# Altium schematic sheet interface.SchDoc: Interface
size OrCAD B; CheckedBy: liuchao; DrawnBy: liuchao; DocumentNumber: APEX-USB7; Revision: 3.0.0; SheetNumber: 7; SheetTotal: 9
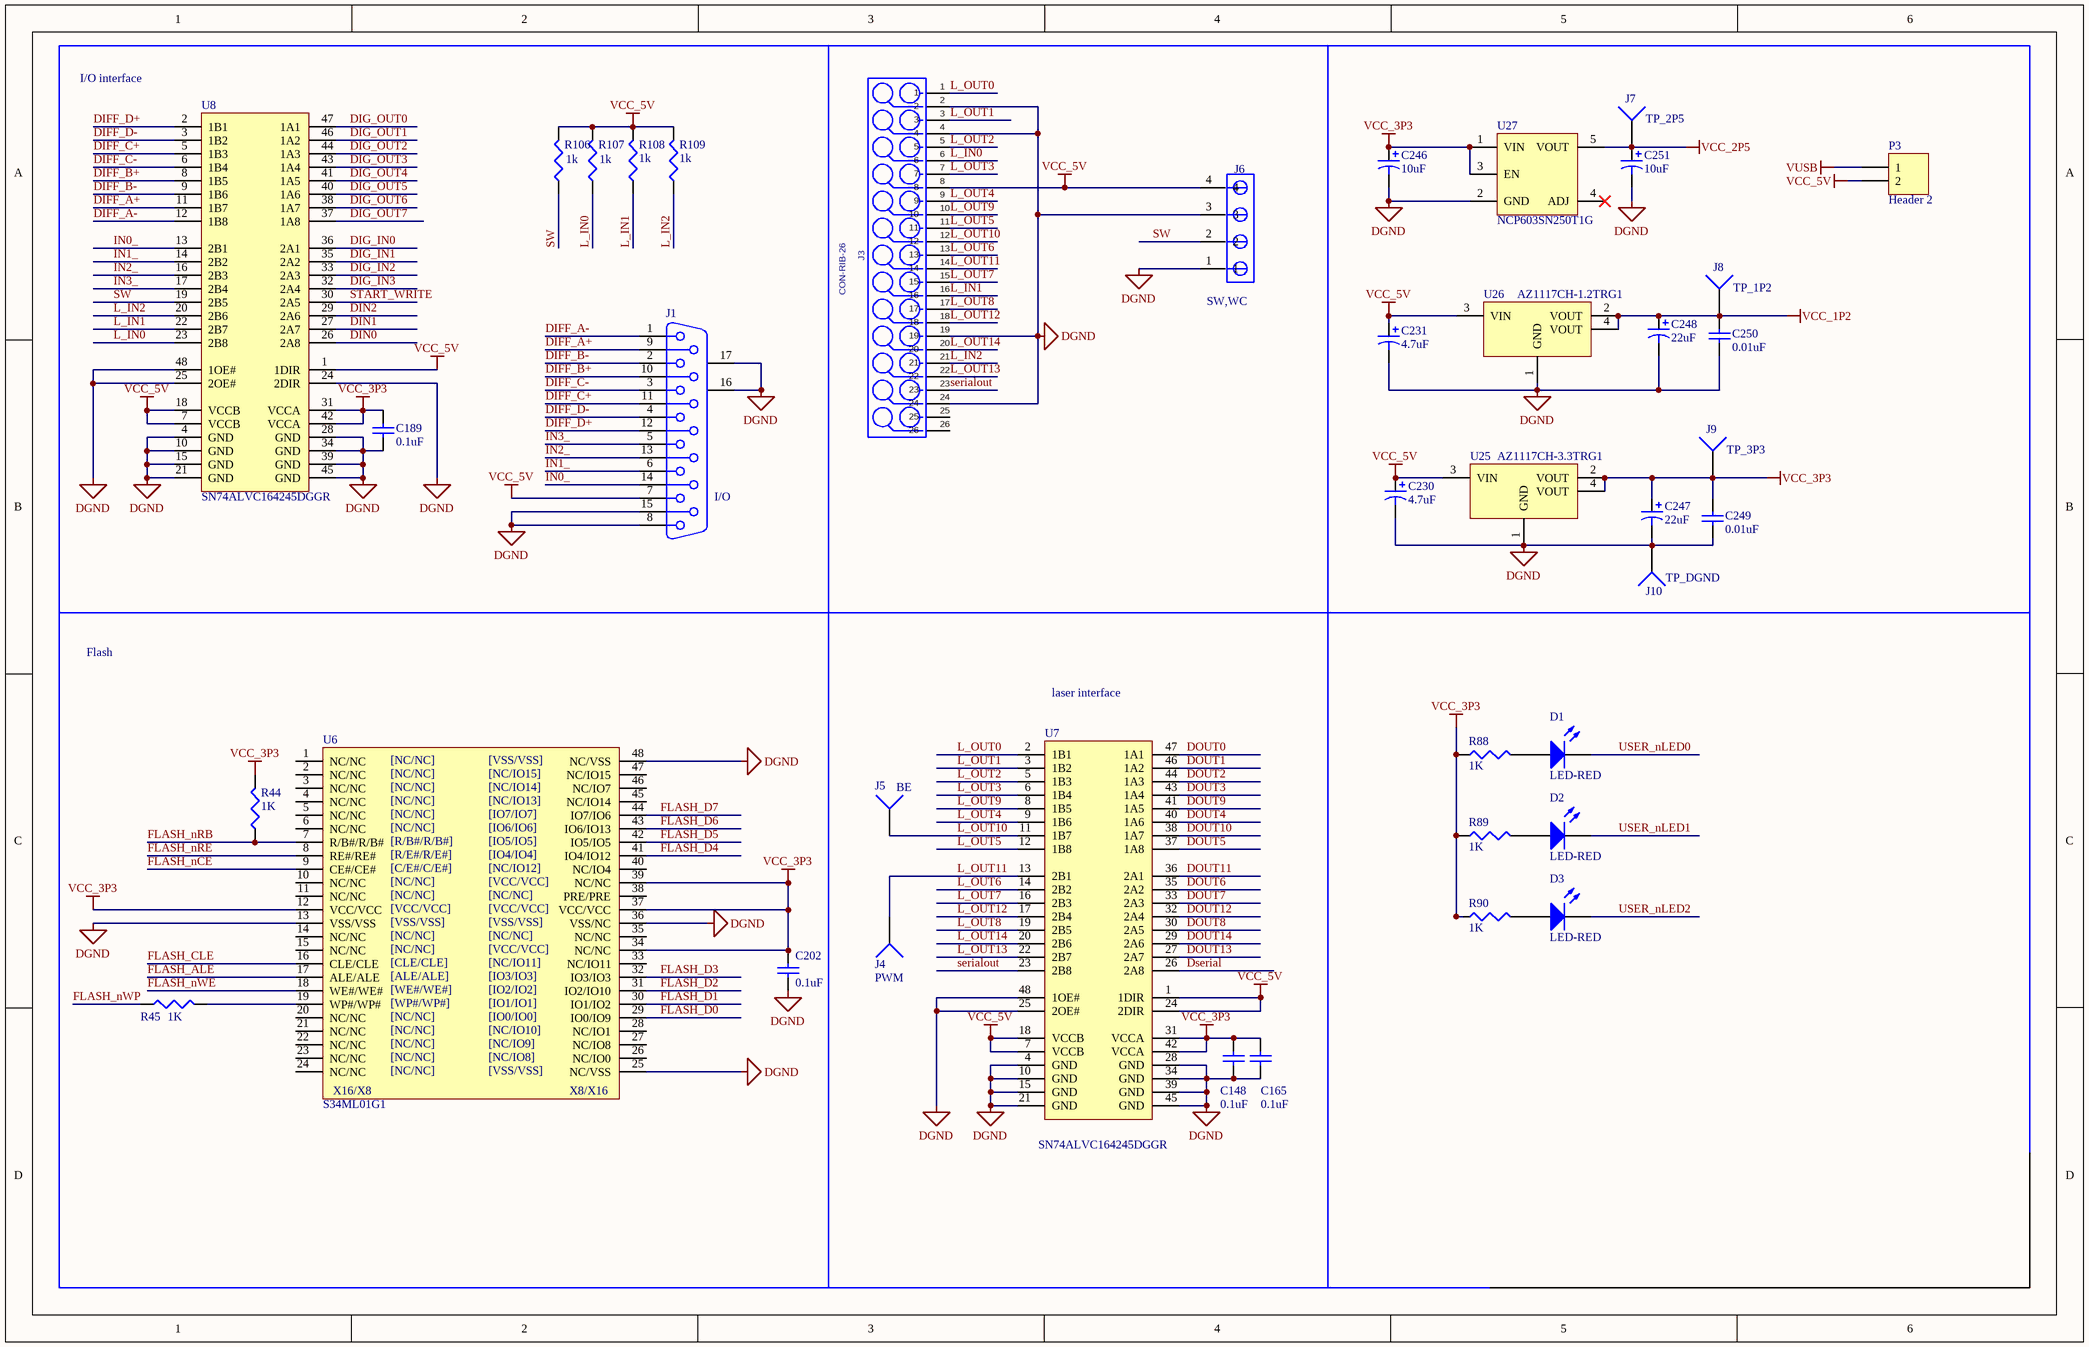
[diagram p0: interface.SchDoc]

## Parts
C148  value 0.1uF  [C_0402]  (hidden comment: Capacitor)
C165  value 0.1uF  [C_0402]  (hidden comment: Capacitor)
C189  value 0.1uF  [C_0402]  (hidden comment: Capacitor)
C202  value 0.1uF  [C_0402]  (hidden comment: Capacitor)
C230  value 4.7uF  [CAP_B]  (hidden comment: Polarized Capacitor)
C231  value 4.7uF  [CAP_B]  (hidden comment: Polarized Capacitor)
C246  value 10uF  [CAP_B]  (hidden comment: Polarized Capacitor)
C247  value 22uF  [CAP_B]  (hidden comment: Polarized Capacitor)
C248  value 22uF  [CAP_B]  (hidden comment: Polarized Capacitor)
C249  value 0.01uF  [C_0402]  (hidden comment: Capacitor)
C250  value 0.01uF  [C_0402]  (hidden comment: Capacitor)
C251  value 10uF  [CAP_B]  (hidden comment: Polarized Capacitor)
D1  LED-RED  [3.2X1.6X1.1]
D2  LED-RED  [3.2X1.6X1.1]
D3  LED-RED  [3.2X1.6X1.1]
J1  I/O  [DB15]
J3  CON-RIB-26  [H26-2P54-DIP]
J4  PWM  [1PAD]
J5  BE  [1PAD]
J6  value SW,WC  [2510-4P]  (hidden comment: SIP-4P-100)
J7  TP_2P5  [1PAD]
J8  TP_1P2  [1PAD]
J9  TP_3P3  [1PAD]
J10  TP_DGND  [1PAD]
P3  Header 2  [HDR1X2]
R44  value 1K  [J1-0603]  (hidden comment: Resistor)
R45  value 1K  [J1-0603]  (hidden comment: Resistor)
R88  value 1K  [J1-0603]  (hidden comment: Resistor)
R89  value 1K  [J1-0603]  (hidden comment: Resistor)
R90  value 1K  [J1-0603]  (hidden comment: Resistor)
R106  value 1k  [J1-0603]  (hidden comment: Resistor)
R107  value 1k  [J1-0603]  (hidden comment: Resistor)
R108  value 1k  [J1-0603]  (hidden comment: Resistor)
R109  value 1k  [J1-0603]  (hidden comment: Resistor)
U6  S34ML01G1  [TSOP48]
U7  SN74ALVC164245DGGR  [TSSOP48_N]
U8  SN74ALVC164245DGGR  [TSSOP48_N]
U25  AZ1117CH-3.3TRG1  [SOT223_N]
U26  AZ1117CH-1.2TRG1  [SOT223_N]
U27  NCP603SN250T1G  [TSOP_5]

## Nets
DGND: C148.2 C165.1 C189.1 C202.1 C230.2 C231.2 C246.2 C247.2 C248.2 C249.2 C250.2 C251.2 J1.8 J1.15 J1.16(MH1) J1.17(MH2) J3.2 J3.4 J3.19 J3.24 J6.1 J6.3 J10.1 U6.13(VSS/VSS) U6.25(NC/VSS) U6.36(VSS/NC) U6.48(NC/VSS) U7.4(GND) U7.10(GND) U7.15(GND) U7.21(GND) U7.25(2OE#) U7.28(GND) U7.34(GND) U7.39(GND) U7.45(GND) U7.48(1OE#) U8.4(GND) U8.10(GND) U8.15(GND) U8.21(GND) U8.24(2DIR) U8.25(2OE#) U8.28(GND) U8.34(GND) U8.39(GND) U8.45(GND) U8.48(1OE#) U25.1(GND) U26.1(GND) U27.2(GND)
VCC_1P2: C248.1 C250.1 J8.1 U26.2(VOUT) U26.4(VOUT)
VCC_2P5: C251.1 J7.1 U27.5(VOUT)
VCC_3P3: C148.1 C165.2 C189.2 C202.2 C246.1 C247.1 C249.1 J9.1 R44.2 R88.1 R89.1 R90.1 U6.12(VCC/VCC) U6.34(NC/NC) U6.37(VCC/VCC) U6.39(NC/NC) U7.31(VCCA) U7.42(VCCA) U8.31(VCCA) U8.42(VCCA) U25.2(VOUT) U25.4(VOUT) U27.1(VIN) U27.3(EN)
VCC_5V: C230.1 C231.1 J1.7 J3.8 J6.4 P3.2 R106.2 R107.2 R108.2 R109.2 U7.1(1DIR) U7.7(VCCB) U7.18(VCCB) U7.24(2DIR) U8.1(1DIR) U8.7(VCCB) U8.18(VCCB) U25.3(VIN) U26.3(VIN)
VUSB: P3.1
DIFF_A+: J1.9 U8.11(1B7)
DIFF_A-: J1.1 U8.12(1B8)
DIFF_B+: J1.10 U8.8(1B5)
DIFF_B-: J1.2 U8.9(1B6)
DIFF_C+: J1.11 U8.5(1B3)
DIFF_C-: J1.3 U8.6(1B4)
DIFF_D+: J1.12 U8.2(1B1)
DIFF_D-: J1.4 U8.3(1B2)
DIG_IN0: U8.36(2A1)
DIG_IN1: U8.35(2A2)
DIG_IN2: U8.33(2A3)
DIG_IN3: U8.32(2A4)
DIG_OUT0: U8.47(1A1)
DIG_OUT1: U8.46(1A2)
DIG_OUT2: U8.44(1A3)
DIG_OUT3: U8.43(1A4)
DIG_OUT4: U8.41(1A5)
DIG_OUT5: U8.40(1A6)
DIG_OUT6: U8.38(1A7)
DIG_OUT7: U8.37(1A8)
DIN0: U8.26(2A8)
DIN1: U8.27(2A7)
DIN2: U8.29(2A6)
DOUT0: U7.47(1A1)
DOUT1: U7.46(1A2)
DOUT2: U7.44(1A3)
DOUT3: U7.43(1A4)
DOUT4: U7.40(1A6)
DOUT5: U7.37(1A8)
DOUT6: U7.35(2A2)
DOUT7: U7.33(2A3)
DOUT8: U7.30(2A5)
DOUT9: U7.41(1A5)
DOUT10: U7.38(1A7)
DOUT11: U7.36(2A1)
DOUT12: U7.32(2A4)
DOUT13: U7.27(2A7)
DOUT14: U7.29(2A6)
Dserial: U7.26(2A8)
FLASH_ALE: U6.17(ALE/ALE)
FLASH_CLE: U6.16(CLE/CLE)
FLASH_D0: U6.29(IO0/IO9)
FLASH_D1: U6.30(IO1/IO2)
FLASH_D2: U6.31(IO2/IO10)
FLASH_D3: U6.32(IO3/IO3)
FLASH_D4: U6.41(IO4/IO12)
FLASH_D5: U6.42(IO5/IO5)
FLASH_D6: U6.43(IO6/IO13)
FLASH_D7: U6.44(IO7/IO6)
FLASH_nCE: U6.9(CE#/CE#)
FLASH_nRB: R44.1 U6.7(R/B#/R/B#)
FLASH_nRE: U6.8(RE#/RE#)
FLASH_nWE: U6.18(WE#/WE#)
FLASH_nWP: R45.1
IN0_: J1.14 U8.13(2B1)
IN1_: J1.6 U8.14(2B2)
IN2_: J1.13 U8.16(2B3)
IN3_: J1.5 U8.17(2B4)
L_IN0: J3.6 R107.1 U8.23(2B8)
L_IN1: J3.16 R108.1 U8.22(2B7)
L_IN2: J3.21 R109.1 U8.20(2B6)
L_OUT0: J3.1 U7.2(1B1)
L_OUT1: J3.3 U7.3(1B2)
L_OUT2: J3.5 U7.5(1B3)
L_OUT3: J3.7 U7.6(1B4)
L_OUT4: J3.9 U7.9(1B6)
L_OUT5: J3.11 U7.12(1B8)
L_OUT6: J3.13 U7.14(2B2)
L_OUT7: J3.15 U7.16(2B3)
L_OUT8: J3.17 U7.19(2B5)
L_OUT9: J3.10 U7.8(1B5)
L_OUT10: J3.12 J5.1 U7.11(1B7)
L_OUT11: J3.14 J4.1 U7.13(2B1)
L_OUT12: J3.18 U7.17(2B4)
L_OUT13: J3.22 U7.22(2B7)
L_OUT14: J3.20 U7.20(2B6)
serialout: J3.23 U7.23(2B8)
START_WRITE: U8.30(2A5)
SW: J6.2 R106.1 U8.19(2B5)
USER_nLED0: D1.2(K)
USER_nLED1: D2.2(K)
USER_nLED2: D3.2(K)
NetD1_1: D1.1(A) R88.2
NetD2_1: D2.1(A) R89.2
NetD3_1: D3.1(A) R90.2
NetR45_2: R45.2 U6.19(WP#/WP#)

Not connected (* = marked no-connect by the designer): J3 25 26; U6 1(NC/NC) 2(NC/NC) 3(NC/NC) 4(NC/NC) 5(NC/NC) 6(NC/NC) 10(NC/NC) 11(NC/NC) 14(NC/NC) 15(NC/NC) 20(NC/NC) 21(NC/NC) 22(NC/NC) 23(NC/NC) 24(NC/NC) 26(NC/IO0) 27(NC/IO8) 28(NC/IO1) 33(NC/IO11) 35(NC/NC) 38(PRE/PRE) 40(NC/IO4) 45(NC/IO14) 46(NC/IO7) 47(NC/IO15); U27 4(ADJ)*

## Notes on the sheet
- I/O interface
- Flash
- laser interface
- (in symbol K9F1GXXU0M) [NC/NC]; [VSS/VSS]; [NC/IO15]; [NC/IO14]; [NC/IO13]; [IO7/IO7]; [IO6/IO6]; [R/B#/R/B#]; [IO5/IO5]; [R/E#/R/E#]; [IO4/IO4]; [C/E#/C/E#]; [NC/IO12]; [VCC/VCC]; [CLE/CLE]; [NC/IO11]; [ALE/ALE]; [IO3/IO3]; [WE#/WE#]; [IO2/IO2]; [WP#/WP#]; [IO1/IO1]; [IO0/IO0]; [NC/IO10]; [NC/IO9]; [NC/IO8]; X16/X8; X8/X16

## Library data of the parts
C148 C165 C189 C202 C249 C250 = Cap Semi: Capacitor (Semiconductor SIM Model); Published: 8-Jun-2000; LatestRevisionDate: 29-May-2009; LatestRevisionNote: IPC-7351 Footprint Added.; PackageReference: C1206; Publisher: Altium Limited; PackageDescription: Chip Capacitor
C230 C231 C246-C248 C251 = Cap Pol3: Polarized Capacitor (Surface Mount); Published: 8-Jun-2000; LatestRevisionDate: 29-May-2009; LatestRevisionNote: IPC-7351 Footprint Added.; PackageReference: C0805; Publisher: Altium Limited; PackageDescription: Chip Capacitor
D1-D3 = LED2: Typical RED, GREEN, YELLOW, AMBER GaAs LED; Published: 8-Jun-2000; LatestRevisionDate: 17-Jul-2002; LatestRevisionNote: Re-released for DXP Platform.; PackageVersion: Feb-2002; PackageReference: 3.2X1.6X1.1; Publisher: Altium Limited; PackageDescription: SM LED; 2 Flat Leads
J1 = D Connector 15: Receptacle Assembly, 15 Position, Right Angle; PackageDocument: O; Positions: 15; Published: 15-Jun-2001; LatestRevisionDate: 17-Jul-2002; LatestRevisionNote: Re-released for DXP Platform.; DatasheetDocument: 1-Sep-99; PackageReference: 788757; Publisher: Altium Limited; Orientation: Right Angle; Gender: Receptacle
J3 = CON-RIB-26: CONN HEADER 26POS DUAL VERT PCB; Manufacturer #1: dg-key 609-1756-ND; MFG #1: 71918-126LF; PCB DECAL: CON-RIB-26; Cost: 3.44; Manufacturer #2: FCI
J4 J5 J7-J10 = Socket: LatestRevisionDate: 17-Jul-2002; LatestRevisionNote: Re-released for DXP Platform.; Publisher: Altium Limited
J6 = HEADER_4: Manufacturer #1: DIGIKEY-WM4802-ND; Spil Part #: 70543-0003; PCB DECAL: SIP-4P; Cost: 1.14
P3 = Header 2: Header, 2-Pin; LatestRevisionDate: 17-Jul-2002; LatestRevisionNote: Re-released for DXP Platform.; Publisher: Altium Limited
R44 R45 R88-R90 R106-R109 = Res3: Published: 8-Jun-2000; LatestRevisionDate: 29-May-2009; LatestRevisionNote: IPC-7351 Footprint Added.; PackageReference: J1-0603; Publisher: Altium Limited; PackageDescription: Chip Resistor
U6 = K9F1GXXU0M: NAND Flash
U7 U8 = SN74ALVC164245: Transceiver With 3-  State Outputs
U25 U26 = VR3.3V
U27 = NCP603SN: CMOS LDO Regulator